# EAGLE design az_vert_evef (EAGLE 9.6.2)
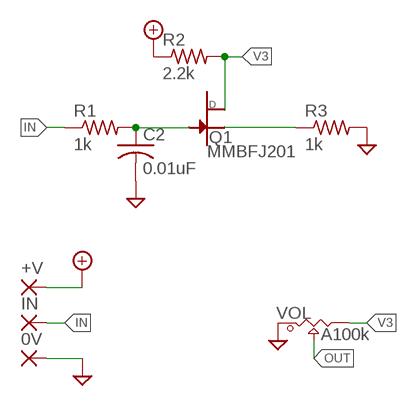
[diagram p0: schematic, sheet 1]

## Parts
0V  SMD2  [SMD1,27-2,54]
+V  SMD2  [SMD1,27-2,54]
C2  0.01uF  C-USC0603  [C0603]
IN  SMD2  [SMD1,27-2,54]
Q1  MMBFJ201  [MMBFJ201]
R1  1k  R-US_R0603  [R0603]
R2  2.2k  R-US_R0603  [R0603]
R3  1k  R-US_R0603  [R0603]
VOL  A100k  POT_9MM_SMD  [POT_9MM_SMD]

## Nets
+9V: +V.1(P) R2.1
GND: 0V.1(P) C2.2 R3.2 VOL.1
IN: IN.1(P) R1.1
N$1: C2.1 Q1.G R1.2
N$2: Q1.S R3.1
OUT: VOL.2
V3: Q1.D R2.2 VOL.3

## Library data of the parts
0V +V IN = wirepad:SMD2: SMD PAD
C2 = adafruit:C-US: CAPACITOR, American symbol
Q1 = SOT23_201:MMBFJ201
R1-R3 = adafruit:R-US_: RESISTOR, American symbol
VOL = Mech_BO_CE_SW:POT_9MM_SMD

## Board
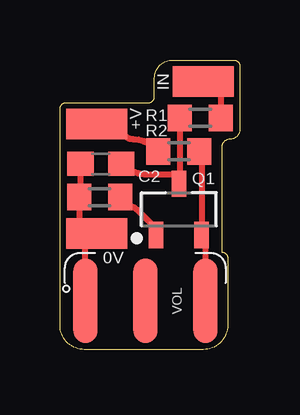
[diagram p1: board, top side]

Size 7.49 x 12.06 mm. Coordinates in mm from the lower left corner, seen from the top.
Outline: 6.99,3.81 6.99,1.02 arc-90 5.97,0 1.02,0 arc-90 0,1.02 0,10.03 arc-90 0.25,10.29 3.68,10.29 arc90 3.94,10.54 3.94,11.3 arc-90 4.7,12.06 7.24,12.06 arc-90 7.49,11.81 7.49,9.17 arc-90 7.09,8.76 arc90 6.73,8.41 6.73,4.06 arc-90 6.99,3.81
Copper layers (1*16): Top 0.035mm / dielectric 1.5mm / Bottom 0.035mm
Design rules "default *": minimum track width 6mil, minimum drill 0.35mm, track to track 6mil, track to pad 6mil, pad to pad 6mil, via to via 6mil, smd to smd 6mil, copper to edge 10mil, drill to drill 6mil, minimum pad ring 10mil, minimum via ring 8mil, stop-mask expansion 4mil, vias tented up to drill 0mil, thermal gap 10mil

### Footprints (pad centres in the part's own frame; a part is rotated, then mirrored left to right if it is on the bottom)
SMD1,27-2,54 = smd 1.27 x 2.54: 1 0,0
C0603 = smd 1.1 x 1: 1 -0.85,0; 2 0.85,0
MMBFJ201 = smd 1.099 x 0.602: D -1.065,-0.95; G 1.065,0; S -1.065,0.95
R0603 = smd 1 x 1.1: 1 -0.85,0; 2 0.85,0
POT_9MM_SMD = smd 0.991 x 3.505: 1 -2.5,0; 2 0,0; 3 2.5,0

### Placement (x,y rotation side)
0V  1.52,4.83 90 top
+V  1.52,9.4 90 top
C2  1.7,7.75 180 top
IN  5.97,11.18 90 top
Q1  4.95,5.84 90 top
R1  5.84,9.65 180 top
R2  4.95,8.26 0 top
R3  1.65,6.35 180 top
VOL  3.56,2.03 0 top

### Tracks (layer width: path | path; a pad name or v marks a point on that pad's centre or on a via)
+9V
  Top 0.254: +V.1 2.03,8.89 2.73,8.89 arc45 3.03,8.76 arc-45 3.99,8.37 R2.1
GND
  Top 0.254: VOL.1 1.06,4.36 1.4,4.7 | 1.4,4.7 0V.1 | 1.4,4.7 1.27,4.7 0.76,5.21 0.8,5.25 R3.2 0.85,6.4 C2.2
IN
  Top 0.254: IN.1 6.22,11.18 6.69,10.71 R1.1
N$1
  Top 0.254: R1.2 4.99,6.95 Q1.G 4.95,7.16 4.83,7.29 3.66,7.29 arc-45 C2.1
N$2
  Top 0.254: R3.1 2.88,5.97 arc-45 3.19,5.84 4,5.03 Q1.S
V3
  Top 0.254: Q1.D 5.91,4.77 | 5.91,4.77 6.06,4.62 VOL.3 | R2.2 5.91,8.15 5.91,4.77